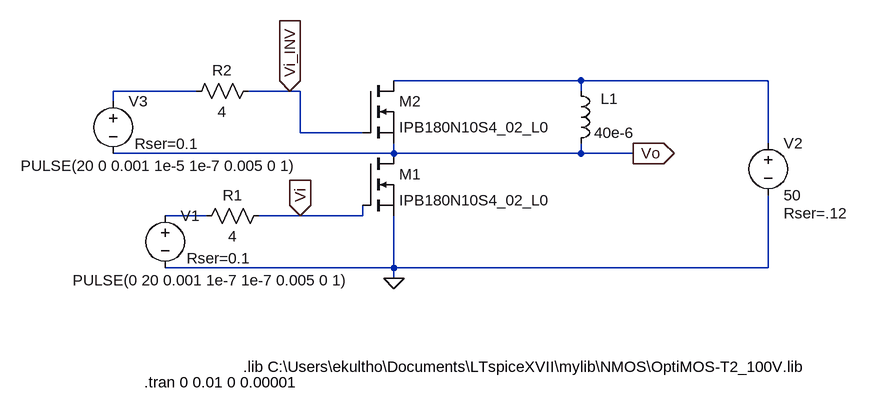
[diagram p0: schematic Push Pull Config.asc]
Push Pull Config.asc, the LTspice schematic file:
Version 4
SHEET 1 916 680
WIRE 400 -16 112 -16
WIRE 688 -16 400 -16
WIRE -192 0 -320 0
WIRE -48 0 -112 0
WIRE -32 0 -48 0
WIRE 400 0 400 -16
WIRE -320 16 -320 0
WIRE -32 64 -32 0
WIRE 64 64 -32 64
WIRE 688 80 688 -16
WIRE 112 96 112 80
WIRE 112 96 -320 96
WIRE 400 96 400 80
WIRE 400 96 112 96
WIRE 480 96 400 96
WIRE -176 192 -240 192
WIRE -32 192 -96 192
WIRE 64 192 64 176
WIRE 64 192 -32 192
WIRE 112 272 112 192
WIRE 112 272 -240 272
WIRE 688 272 688 160
WIRE 688 272 112 272
WIRE 112 288 112 272
FLAG 112 288 0
FLAG 480 96 Vo
IOPIN 480 96 Out
FLAG -32 192 Vi
IOPIN -32 192 In
FLAG -48 0 Vi_INV
IOPIN -48 0 In
SYMBOL nmos 64 96 R0
SYMATTR InstName M1
SYMATTR Value IPB180N10S4_02_L0
SYMATTR Prefix X
SYMBOL voltage -240 176 R0
WINDOW 3 -142 115 Left 2
WINDOW 123 24 124 Left 2
WINDOW 39 33 81 Left 2
SYMATTR Value PULSE(0 20 0.001 1e-7 1e-7 0.005 0 1)
SYMATTR SpiceLine Rser=0.1
SYMATTR InstName V1
SYMBOL voltage 688 64 R0
WINDOW 123 0 0 Left 0
WINDOW 39 24 124 Left 2
SYMATTR SpiceLine Rser=.12
SYMATTR InstName V2
SYMATTR Value 50
SYMBOL ind 384 -16 R0
WINDOW 0 46 28 Left 2
SYMATTR InstName L1
SYMATTR Value 40e-6
SYMATTR SpiceLine Rser=.2 Cpar=1e-9
SYMBOL res -80 176 R90
WINDOW 0 0 56 VBottom 2
WINDOW 3 32 56 VTop 2
SYMATTR InstName R1
SYMATTR Value 4
SYMBOL nmos 64 -16 R0
SYMATTR InstName M2
SYMATTR Value IPB180N10S4_02_L0
SYMATTR Prefix X
SYMBOL voltage -320 0 R0
WINDOW 3 -142 115 Left 2
WINDOW 123 24 124 Left 2
WINDOW 39 33 81 Left 2
SYMATTR Value PULSE(20 0 0.001 1e-5 1e-7 0.005 0 1)
SYMATTR SpiceLine Rser=0.1
SYMATTR InstName V3
SYMBOL res -96 -16 R90
WINDOW 0 0 56 VBottom 2
WINDOW 3 32 56 VTop 2
SYMATTR InstName R2
SYMATTR Value 4
TEXT -120 424 Left 2 !.lib C:\\Users\\ekultho\\Documents\\LTspiceXVII\\mylib\\NMOS\\OptiMOS-T2_100V.lib
TEXT -272 448 Left 2 !.tran 0 0.01 0 0.00001

The netlist it stands for:
* Push Pull Config.asc
XM1 Vo Vi 0 IPB180N10S4_02_L0  ; pins D G S
V1 N003 0 PULSE(0 20 0.001 1e-7 1e-7 0.005 0 1) Rser=0.1
V2 N001 0 50 Rser=.12
L1 N001 Vo 40e-6 Rser=.2 Cpar=1e-9
R1 Vi N003 4
XM2 N001 Vi_INV Vo IPB180N10S4_02_L0  ; pins D G S
V3 N002 Vo PULSE(20 0 0.001 1e-5 1e-7 0.005 0 1) Rser=0.1
R2 Vi_INV N002 4
.lib C:\Users\ekultho\Documents\LTspiceXVII\mylib\NMOS\OptiMOS-T2_100V.lib
.tran 0 0.01 0 0.00001
.backanno
.end

* Results of the author's LTspice run, read from the files saved beside the schematic
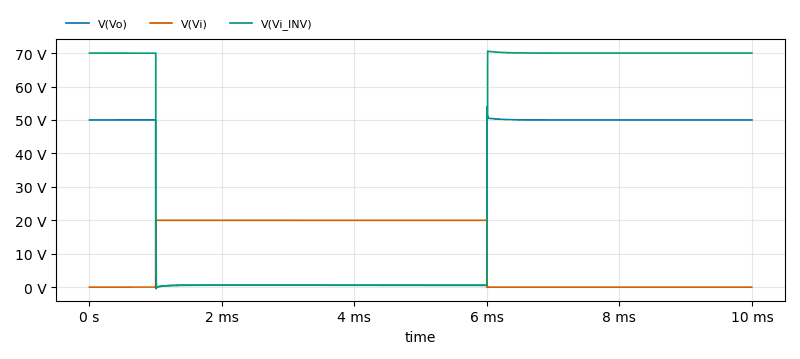
[diagram p1: Transient Analysis of Push Pull Config.asc, plotted from the saved traces]
* Transient Analysis, 1 run:
*   V(Vo): min -502 mV, max 53.97 V, average 25.3 V, rms 35.37 V, last 50 V
*   V(Vi): min -112.6 mV, max 20.25 V, average 10 V, rms 14.14 V, last 20.5 µV
*   V(Vi_INV): min 15.5 mV, max 70.56 V, average 35.29 V, rms 49.49 V, last 70 V